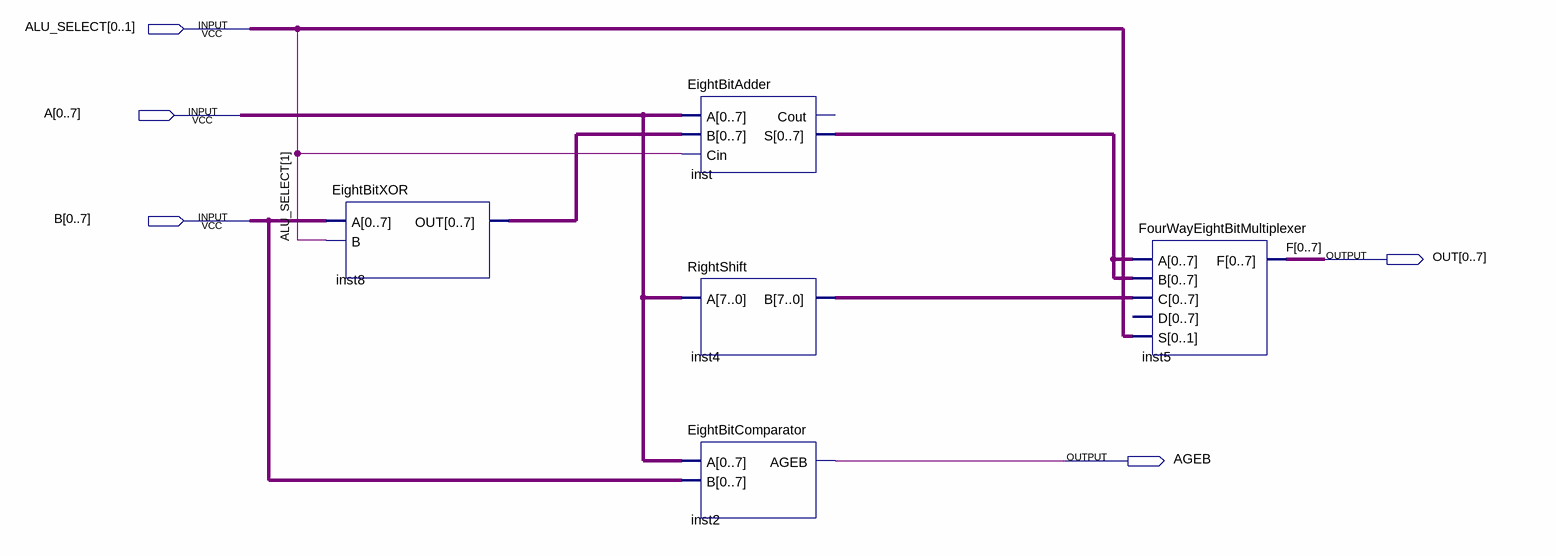
[diagram p0: schematic sheet]
// Quartus schematic ALU.bdf as structural Verilog: 5 symbols, 5 pins
module ALU (
  input  [0:1] ALU_SELECT,
  input  [0:7] A,
  input  [0:7] B,
  output [0:7] OUT,
  output AGEB
);

  wire [7:0] inst4_b, inst8_out, inst_s;

  EightBitXOR inst8 (.A(B), .B(ALU_SELECT[1]), .OUT(inst8_out));
  EightBitAdder inst (.A(A), .B(inst8_out), .Cin(ALU_SELECT[1]), .S(inst_s));  // open: Cout
  RightShift inst4 (.A(A), .B(inst4_b));
  EightBitComparator inst2 (.A(A), .B(B), .AGEB(AGEB));
  FourWayEightBitMultiplexer inst5 (.A(inst_s), .B(inst_s), .C(inst4_b), .S(ALU_SELECT), .F(OUT));  // open: D

  // Other names for the same wires on the sheet: F[7:0] = {OUT[7], OUT[6], OUT[5], OUT[4], OUT[3], OUT[2], OUT[1], OUT[0]}
endmodule
